# Altium schematic sheet 09 - M.2-SDMMC2.SchDoc
size B; CompanyName: Microchip Technology Inc.; Organization: Microchip Technology; Address1: 2355 West Chandler Blvd.; Address2: Chandler, AZ  85224; Address4: USA; DocumentNumber: 9; SheetNumber: 9; SheetTotal: 15; SheetTitle: M.2  Connector
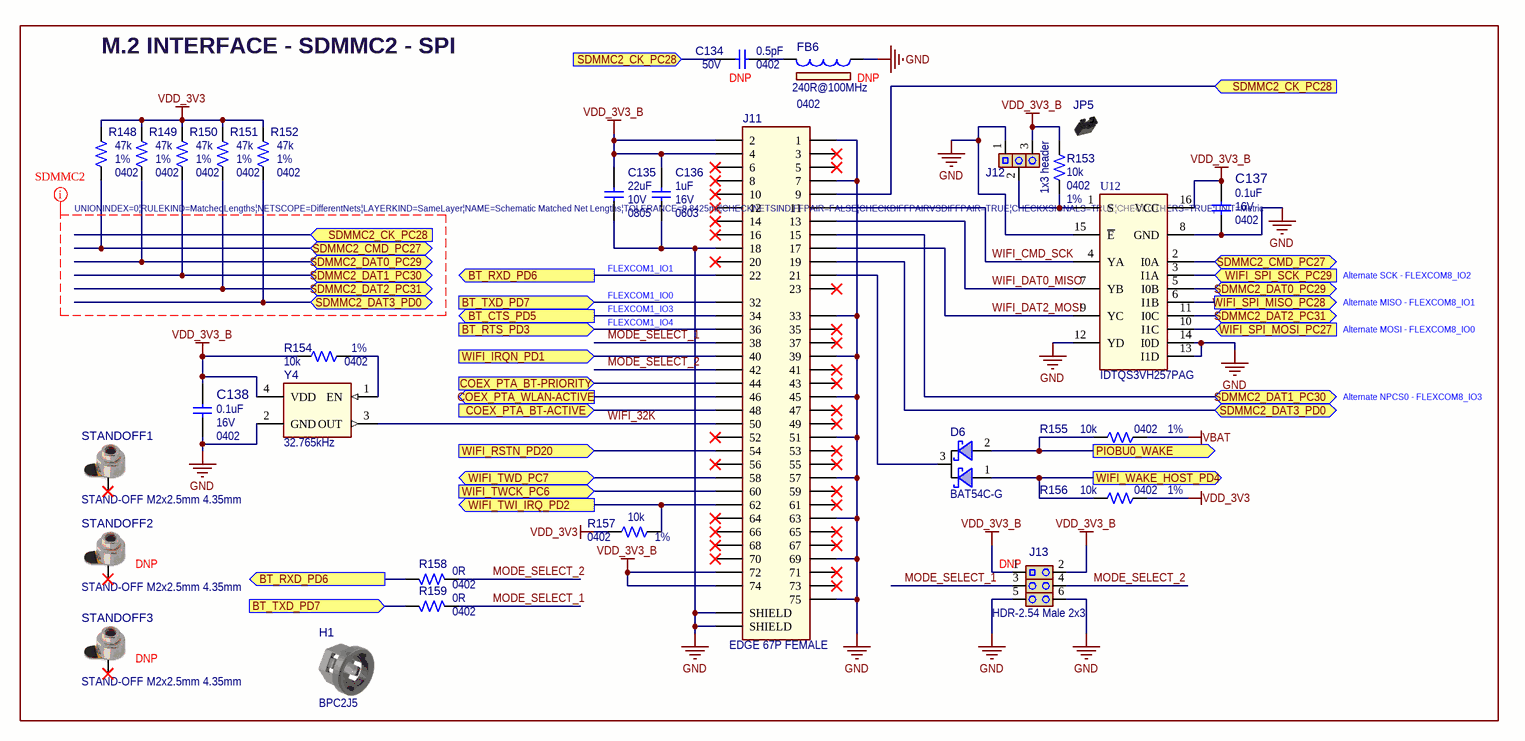
[diagram p0: 09 - M.2-SDMMC2.SchDoc]

## Parts
C134  value 0.5pF  Voltage: 50V  Package: 0402  Populated: DNP  [CAP_C_0402]  (hidden comment: Capacitor NP)
C135  value 22uF  Voltage: 10V  Package: 0805  [CAP_C_0805]  (hidden comment: Capacitor NP)
C136  value 1uF  Voltage: 16V  Package: 0603  [CAP_C_0603]  (hidden comment: Capacitor NP)
C137  value 0.1uF  Voltage: 16V  Package: 0402  [CAP_C_0402]  (hidden comment: Capacitor NP)
C138  value 0.1uF  Voltage: 16V  Package: 0402  [CAP_C_0402]  (hidden comment: Capacitor NP)
D6  value BAT54C-G  [SOT-23-3]  (hidden comment: Diode Schottky Dual CK)
FB6  value 240R@100MHz  Package: 0402  Populated: DNP  [IND_C_0402]  (hidden comment: Ferrite Bead)
H1  BPC2J5  [BPC2J5]  (no BOM)
J11  value EDGE 67P FEMALE  [CON_EDGE-CARD_SMD_RA_TE_2199230-4]  (hidden comment: CONN EDGE DUAL FEMALE_2199230-4)
J12  value 1x3 header  [HDR_M_2.54_1x3]  (hidden comment: Header 1x3)
J13  value HDR-2.54 Male 2x3  Populated: DNP  [HDR_M_2.54_2x3]  (hidden comment: Header 2x3)
JP5  Jumper Mechanical  [Jumper_Mechanical]  (value not drawn)  (mechanical)
R148  value 47k  Package: 0402  Tolerance: 1%  [RES_C_0402]  (hidden comment: Resistor)
R149  value 47k  Package: 0402  Tolerance: 1%  [RES_C_0402]  (hidden comment: Resistor)
R150  value 47k  Package: 0402  Tolerance: 1%  [RES_C_0402]  (hidden comment: Resistor)
R151  value 47k  Package: 0402  Tolerance: 1%  [RES_C_0402]  (hidden comment: Resistor)
R152  value 47k  Package: 0402  Tolerance: 1%  [RES_C_0402]  (hidden comment: Resistor)
R153  value 10k  Package: 0402  Tolerance: 1%  [RES_C_0402]  (hidden comment: Resistor)
R154  value 10k  Package: 0402  Tolerance: 1%  [RES_C_0402]  (hidden comment: Resistor)
R155  value 10k  Package: 0402  Tolerance: 1%  [RES_C_0402]  (hidden comment: Resistor)
R156  value 10k  Package: 0402  Tolerance: 1%  [RES_C_0402]  (hidden comment: Resistor)
R157  value 10k  Package: 0402  Tolerance: 1%  [RES_C_0402]  (hidden comment: Resistor)
R158  value 0R  Package: 0402  [RES_C_0402]  (hidden comment: Resistor)
R159  value 0R  Package: 0402  [RES_C_0402]  (hidden comment: Resistor)
STANDOFF1  value STAND-OFF M2x2.5mm 4.35mm  [MECH_HW_STAND-OFF_9774025243]  (hidden comment: Standoff M-F)
STANDOFF2  value STAND-OFF M2x2.5mm 4.35mm  Populated: DNP  [MECH_HW_STAND-OFF_9774025243]  (hidden comment: Standoff M-F)
STANDOFF3  value STAND-OFF M2x2.5mm 4.35mm  Populated: DNP  [MECH_HW_STAND-OFF_9774025243]  (hidden comment: Standoff M-F)
U12  value IDTQS3VH257PAG  [TSSOP-16]  (hidden comment: IDTQS3VH257 TSSOP-16)
Y4  value 32.765kHz  [OSCILLATOR_ASAK_L2W1.6H0.7]  (hidden comment: OSCILLATOR 4 Pins)

## Ports
BT_CTS_PD5 (out), BT_RTS_PD3 (in), BT_RXD_PD6 (out), BT_TXD_PD7 (in), COEX_PTA_BT-ACTIVE (in), COEX_PTA_BT-PRIORITY (in), COEX_PTA_WLAN-ACTIVE (out), PIOBU0_WAKE (out), SDMMC2_CK_PC28 (in), SDMMC2_CMD_PC27 (bidir), SDMMC2_DAT0_PC29 (bidir), SDMMC2_DAT1_PC30 (bidir), SDMMC2_DAT2_PC31 (bidir), SDMMC2_DAT3_PD0 (bidir), WIFI_IRQN_PD1 (in), WIFI_RSTN_PD20 (in), WIFI_SPI_MISO_PC28 (out), WIFI_SPI_MOSI_PC27 (in), WIFI_SPI_SCK_PC29 (in), WIFI_TWCK_PC6 (in), WIFI_TWD_PC7 (bidir), WIFI_TWI_IRQ_PD2 (out), WIFI_WAKE_HOST_PD4 (out)

## Nets
GND: C135.1 C136.1 C137.2 C138.2 FB6.1 J11.1 J11.7 J11.18 J11.33 J11.39 J11.45 J11.51 J11.57 J11.63 J11.69 J11.75 J11.S1(SHIELD) J11.S2(SHIELD) J12.1 J13.5 J13.6 U12.8(GND) U12.12(YD) U12.13(I1D) U12.14(I0D) U12.15(~{E}) Y4.2(GND)
VBAT: R155.1
VDD_3V3: R148.1 R149.1 R150.1 R151.1 R152.1 R156.1 R157.2
VDD_3V3_B: C135.2 C136.2 C137.1 C138.1 J11.2 J11.4 J11.72 J11.74 J12.3 J13.1 J13.2 R153.1 R154.2 U12.16(VCC) Y4.4(VDD)
BT_CTS_PD5: J11.34 ; port BT_CTS_PD5
BT_RTS_PD3: J11.36 ; port BT_RTS_PD3
BT_RXD_PD6: J11.22 R158.1 ; port BT_RXD_PD6
BT_TXD_PD7: J11.32 R159.1 ; port BT_TXD_PD7
COEX_PTA_BT-ACTIVE: J11.48 ; port COEX_PTA_BT-ACTIVE
COEX_PTA_BT-PRIORITY: J11.44 ; port COEX_PTA_BT-PRIORITY
COEX_PTA_WLAN-ACTIVE: J11.46 ; port COEX_PTA_WLAN-ACTIVE
MODE_SELECT_1: J11.38 J13.3 R159.2
MODE_SELECT_2: J11.42 J13.4 R158.2
PIOBU0_WAKE: D6.2(A) R155.2 ; port PIOBU0_WAKE
SDMMC2_CK_PC28: C134.2 J11.9 ; port SDMMC2_CK_PC28
SDMMC2_CMD_PC27: R148.2 U12.2(I0A) ; port SDMMC2_CMD_PC27
SDMMC2_DAT0_PC29: R149.2 U12.5(I0B) ; port SDMMC2_DAT0_PC29
SDMMC2_DAT1_PC30: J11.15 R150.2 ; port SDMMC2_DAT1_PC30
SDMMC2_DAT2_PC31: R151.2 U12.11(I0C) ; port SDMMC2_DAT2_PC31
SDMMC2_DAT3_PD0: J11.19 R152.2 ; port SDMMC2_DAT3_PD0
WIFI_32K: J11.50 Y4.3(OUT)
WIFI_CMD_SCK: J11.11 U12.4(YA)
WIFI_DAT0_MISO: J11.13 U12.7(YB)
WIFI_DAT2_MOSI: J11.17 U12.9(YC)
WIFI_IRQN_PD1: J11.40 ; port WIFI_IRQN_PD1
WIFI_RSTN_PD20: J11.54 ; port WIFI_RSTN_PD20
WIFI_SPI_MISO_PC28: U12.6(I1B) ; port WIFI_SPI_MISO_PC28
WIFI_SPI_MOSI_PC27: U12.10(I1C) ; port WIFI_SPI_MOSI_PC27
WIFI_SPI_SCK_PC29: U12.3(I1A) ; port WIFI_SPI_SCK_PC29
WIFI_TWCK_PC6: J11.60 ; port WIFI_TWCK_PC6
WIFI_TWD_PC7: J11.58 ; port WIFI_TWD_PC7
WIFI_TWI_IRQ_PD2: J11.62 R157.1 ; port WIFI_TWI_IRQ_PD2
WIFI_WAKE_HOST_PD4: D6.1(A) R156.2 ; port WIFI_WAKE_HOST_PD4
NetC134_1: C134.1 FB6.2
NetD6_3: D6.3(KK) J11.21
NetJ12_2: J12.2 R153.2 U12.1(S)
NetR154_1: R154.1 Y4.1(EN)

Not connected (* = marked no-connect by the designer): J11 3* 5* 6* 8* 10* 12* 14* 16* 20* 23* 35* 37* 41* 43* 47* 49* 52* 53* 55* 56* 59* 61* 64* 65* 66* 67* 68* 70* 71* 73*; STANDOFF1 1*; STANDOFF2 1*; STANDOFF3 1*

## Layout directives
net class SDMMC2; rule Matched Net Lengths [Tolerance = 0.25mm]: (no net found under the mark)

## Notes on the sheet
- M.2 INTERFACE - SDMMC2 - SPI
- FLEXCOM1_IO1
- FLEXCOM1_IO0
- Alternate SCK - FLEXCOM8_IO2
- Alternate MISO - FLEXCOM8_IO1
- FLEXCOM1_IO3
- FLEXCOM1_IO4
- Alternate MOSI - FLEXCOM8_IO0
- Alternate NPCS0 - FLEXCOM8_IO3
- Project Owner:
- PCB Layout Contact:
- PartNumber:
- Project Title
- Variant:
- Sheet Title
- Size
- B
- SCH #:
- PCB #:
- Rev:
- Date:
- Sheet
- Designed with
- Altium.com <http://go.altium.com/MicrochipLandingPage_Evaluation.html>
- File:

## Library data of the parts
C134 = CAP0274: Manufacturer 1: KEMET; Manufacturer Part Number 1: C0402C508C5GACTU; Description_: CAP CER 0.5pF 50V 0.25pF NP0 SMD 0402; Dev Tools Status: Production; Tolerance: 0.25pF; Temperature Coefficient: NP0; Type: Ceramic; Restricted Sourcing: No; MCHP-ID: CAP0274; Revision: 2; Symbol: Capacitor NP; Status: MCL Design; ComponentLink1URL: https://chn-vm-apps.microchip.com/mchprepo/parts/Datasheets/MLCC_ordering_code.pdf; ComponentLink1Description: SVN Datasheet; ComponentLink2URL: C:\ALTIUM_WORK\00001_MCHP-CDB\Datasheets\MLCC_ordering_code.pdf; ComponentLink2Description: Local Datasheet; ComponentLink3URL: C:\ALTIUM_WORK\00001_MCHP-CDB\Library\LibraryRefs\Capacitor NP.SchLib; ComponentLink3Description: Open Symbol; ComponentLink4URL: C:\ALTIUM_WORK\00001_MCHP-CDB\Library\Footprints\CAP_C_0402.PcbLib; ComponentLink4Description: Open Footprint; ComponentLink5Description: Open Footprint 2; ComponentLink6Description: Open Footprint 3; ComponentLink7Description: Open Footprint 4; Operating Temperature: -55C to +125C; Category: Capacitor; Manufacturer 2: KYOCERA AVX; Manufacturer Part Number 2: 04025A0R5CAT2A; Manufacturer 3: Yageo; Manufacturer Part Number 3: CC0402CRNPO9BNR50; Supplier 1: Digi-Key; Supplier Part Number 1: 399-1000-2-ND; Supplier 2: Digi-Key; Supplier Part Number 2: 478-1057-2-ND; Supplier 3: Digi-Key; Supplier Part Number 3: 311-1001-2-ND; Quantity Override: 1
C135 = CAP1618: Manufacturer 1: TDK Corporation; Manufacturer Part Number 1: C2012X7S1A226M125AC; Description_: CAP CER 22uF 10V 20% X7S SMD 0805; Dev Tools Status: Production; Tolerance: 20%; Type: Ceramic; Populated: YES; Temperature Coefficient: X7S; Owner: Razvan Cristescu; Restricted Sourcing: No; MCHP-ID: CAP1618; Revision: 3; Symbol: Capacitor NP; Status: MCL Design; ComponentLink1URL: https://chn-vm-apps.microchip.com/mchprepo/parts/Datasheets/mlcc_commercial_general_en.pdf; ComponentLink1Description: SVN Datasheet; ComponentLink2URL: C:\ALTIUM_WORK\00001_MCHP-CDB\Datasheets\mlcc_commercial_general_en.pdf; ComponentLink2Description: Local Datasheet; ComponentLink3URL: C:\ALTIUM_WORK\00001_MCHP-CDB\Library\LibraryRefs\Capacitor NP.SchLib; ComponentLink3Description: Open Symbol; ComponentLink4URL: C:\ALTIUM_WORK\00001_MCHP-CDB\Library\Footprints\CAP_C_0805.PcbLib; ComponentLink4Description: Open Footprint; ComponentLink5Description: Open Footprint 2; ComponentLink6Description: Open Footprint 3; ComponentLink7Description: Open Footprint 4; Operating Temperature: -55C to +125C; Category: Capacitor; Supplier 1: Digi-Key; Supplier Part Number 1: 445-14560-1-ND; Quantity Override: 1
C136 = CAP0265: Manufacturer 1: AVX; Manufacturer Part Number 1: 0603YD105KAT2A; Description_: CAP CER 1uF 16V 10% X5R SMD 0603; Dev Tools Status: Production; Tolerance: 10%; Temperature Coefficient: X5R; Type: Ceramic; Populated: Yes; MCHP-ID: CAP0265; Revision: 4; Symbol: Capacitor NP; Status: MCL Design; ComponentLink1URL: https://chn-vm-apps.microchip.com/mchprepo/parts/Datasheets/smccp.pdf; ComponentLink1Description: SVN Datasheet; ComponentLink2URL: C:\ALTIUM_WORK\00001_MCHP-CDB\Datasheets\smccp.pdf; ComponentLink2Description: Local Datasheet; ComponentLink3URL: C:\ALTIUM_WORK\00001_MCHP-CDB\Library\LibraryRefs\Capacitor NP.SchLib; ComponentLink3Description: Open Symbol; ComponentLink4URL: C:\ALTIUM_WORK\00001_MCHP-CDB\Library\Footprints\CAP_C_0603.PcbLib; ComponentLink4Description: Open Footprint; ComponentLink5Description: Open Footprint 2; ComponentLink6Description: Open Footprint 3; ComponentLink7Description: Open Footprint 4; Operating Temperature: -55C to +85C; Category: Capacitor; Manufacturer 2: KEMET; Manufacturer Part Number 2: C0603C105K4PACTU; Manufacturer 3: TDK; Manufacturer Part Number 3: C1608X5R1C105K080AA; Manufacturer 4: Vishay Vitramon; Manufacturer Part Number 4: VJ0603G105KXJCW1BC; Manufacturer 5: Yageo; Manufacturer Part Number 5: CC0603KRX5R7BB105; Supplier 1: Digi-Key; Supplier Part Number 1: 478-1249-1-ND; Supplier 2: Digi-Key; Supplier Part Number 2: 399-5090-1-ND; Supplier 3: Digi-Key; Supplier Part Number 3: 445-1416-1-ND; Supplier 4: Digi-Key; Supplier Part Number 4: 720-1851-1-ND; Supplier 5: Digi-Key; Supplier Part Number 5: 311-1444-1-ND; Quantity Override: 1
C137 C138 = CAP1033: Manufacturer 1: Hottech; Manufacturer Part Number 1: C1005B104K160NT; Description_: CAP CER 0.1uF 16V 10% X7R SMD 0402; Dev Tools Status: Production; Tolerance: 10%; Owner: Sompoch Loboonlert; Populated: Yes; Temperature Coefficient: X7R; Type: Ceramic; Restricted Sourcing: No; MCHP-ID: CAP1033; Revision: 10; Symbol: Capacitor NP; Status: MCL Design; ComponentLink1URL: https://chn-vm-apps.microchip.com/mchprepo/parts/Datasheets/L0005E.pdf; ComponentLink1Description: SVN Datasheet; ComponentLink2URL: C:\ALTIUM_WORK\00001_MCHP-CDB\Datasheets\L0005E.pdf; ComponentLink2Description: Local Datasheet; ComponentLink3URL: C:\ALTIUM_WORK\00001_MCHP-CDB\Library\LibraryRefs\Capacitor NP.SchLib; ComponentLink3Description: Open Symbol; ComponentLink4URL: C:\ALTIUM_WORK\00001_MCHP-CDB\Library\Footprints\CAP_C_0402.PcbLib; ComponentLink4Description: Open Footprint; ComponentLink5Description: Open Footprint 2; ComponentLink6Description: Open Footprint 3; ComponentLink7Description: Open Footprint 4; Operating Temperature: -55C to +125C; Category: Capacitor; Supplier 1: Hottech; Supplier Part Number 1: C1005B104K160NT; Quantity Override: 1; Manufacturer 2: KEMET; Manufacturer Part Number 2: C0402C104K4RAC7867; Manufacturer 3: Samsung Electro-Mechanics; Manufacturer Part Number 3: CL05B104KO5NNNC; Manufacturer 4: Würth Elektronik; Manufacturer Part Number 4: 885012205037; Manufacturer 5: Samsung Electro-Mechanics; Manufacturer Part Number 5: CL05B104KO5NNND; Manufacturer 6: Samsung Electro-Mechanics; Manufacturer Part Number 6: CL05B104KO5NNNO; Manufacturer 7: Yageo; Manufacturer Part Number 7: CC0402KRX7R7BB104; Supplier 2: Digi-Key; Supplier Part Number 2: 399-C0402C104K4RAC7867TR-ND; Supplier 3: Digi-Key; Supplier Part Number 3: 1276-1001-1-ND; Supplier 4: Digi-Key; Supplier Part Number 4: 732-7532-1-ND; Supplier 5: Mouser; Supplier Part Number 5: 187-CL05B104KO5NNND; Supplier 6: Samsung Electro-Mechanics; Supplier Part Number 6: CL05B104KO5NNNO; Supplier 7: Yageo; Supplier Part Number 7: CC0402KRX7R7BB104
D6 = DIODE1841: Manufacturer 1: Comchip Technology; Description_: DIO SCTKY ARRAY BAT54C-G 520mV 200mA 30V SMD SOT-23-3; Dev Tools Status: Production; Type: Schottky Array; Forward Current: 200mA; Power: 225mW; Reverse Current: 2mA; Reverse Recovery Time: 5ns; Reverse Voltage: 30V; Owner: Cristina Salanti; Populated: YES; Restricted Sourcing: No; MCHP-ID: DIODE1841; Revision: 1; Symbol: Diode Schottky Dual CK; Status: MCL Design; Package: SOT-23-3; ComponentLink1URL: https://chn-vm-apps.microchip.com/mchprepo/parts/Datasheets/BAT54.pdf; ComponentLink1Description: SVN Datasheet; ComponentLink2URL: C:\ALTIUM_WORK\00001_MCHP-CDB\Datasheets\BAT54.pdf; ComponentLink2Description: Local Datasheet; ComponentLink3URL: C:\ALTIUM_WORK\00001_MCHP-CDB\Library\LibraryRefs\Diode Schottky Dual CK.SchLib; ComponentLink3Description: Open Symbol; ComponentLink4URL: C:\ALTIUM_WORK\00001_MCHP-CDB\Library\Footprints\SOT-23-3.PcbLib; ComponentLink4Description: Open Footprint; ComponentLink5Description: Open Footprint 2; ComponentLink6Description: Open Footprint 3; ComponentLink7Description: Open Footprint 4; Operating Temperature: -55C to +125C; Category: Diode; Manufacturer Part Number 1: BAT54C-G; Supplier 1: Digi-Key; Supplier Part Number 1: 641-1320-1-ND; Quantity Override: 1
FB6 = FB1020: Manufacturer 1: TDK Corporation; Manufacturer Part Number 1: MMZ1005Y241CT000; MCHP-ID: FB1020; Description_: FERRITE 240R @100MHz 300mA SMD 0402; Dev Tools Status: Design; Owner: Joerg Buehrer; DCR: 260 mR; Revision: 1; Symbol: Ferrite Bead; Status: MCL Design; ComponentLink1URL: https://chn-vm-apps.microchip.com/mchprepo/parts/Datasheets/beads_commercial_signal_mmz1005_en.pdf; ComponentLink1Description: SVN Datasheet; ComponentLink2URL: C:\ALTIUM_WORK\00001_MCHP-CDB\Datasheets\beads_commercial_signal_mmz1005_en.pdf; ComponentLink2Description: Local Datasheet; ComponentLink3URL: C:\ALTIUM_WORK\00001_MCHP-CDB\Library\LibraryRefs\Ferrite Bead.SchLib; ComponentLink3Description: Open Symbol; ComponentLink4URL: C:\ALTIUM_WORK\00001_MCHP-CDB\Library\Footprints\IND_C_0402.PcbLib; ComponentLink4Description: Open Footprint; ComponentLink5Description: Open Footprint 2; ComponentLink6Description: Open Footprint 3; ComponentLink7Description: Open Footprint 4; Operating Temperature: -55°C ~ 125°C; Type: Ferrite Bead; Category: Inductor; Manufacturer 2: TDK Corporation; Manufacturer Part Number 2: MMZ1005Y241CT000; Supplier 1: Digi-Key; Supplier Part Number 1: 445-2153-1-ND; Supplier 2: Mouser; Supplier Part Number 2: 810-MMZ1005Y241CT000; Quantity Override: 1
H1 = MECH0299: Manufacturer 1: Alead Technology Co., Ltd.; Description_: MECH HW WASHER PCB LOCK PLASTIC BPC2J5; Dev Tools Status: Production; Owner: Dragos Danaila; Populated: MECH; MCHP-ID: MECH0299; Value: BPC2J5; Revision: 1; Symbol: BPC2J5; Status: MCL Design; ComponentLink1Description: SVN Datasheet; ComponentLink2Description: Local Datasheet; ComponentLink3URL: C:\ALTIUM_WORK\00001_MCHP-CDB\Library\LibraryRefs\BPC2J5.SchLib; ComponentLink3Description: Open Symbol; ComponentLink4URL: C:\ALTIUM_WORK\00001_MCHP-CDB\Library\Footprints\BPC2J5.PcbLib; ComponentLink4Description: Open Footprint; ComponentLink5Description: Open Footprint 2; ComponentLink6Description: Open Footprint 3; ComponentLink7Description: Open Footprint 4; Type: Washer; Category: Hardware; Manufacturer Part Number 1: BPC2J5; Supplier 1: Alead Technology Co., Ltd.; Supplier Part Number 1: BPC2J5; Quantity Override: 1
J11 = CON2690: Manufacturer 1: TE Connectivity AMP Connectors; Description_: CON EDGE MINI M.2 0.5mm 67P Female SMD R/A; Dev Tools Status: Design; Owner: Pilar Alcaine; Populated: YES; MCHP-ID: CON2690; Revision: 1; Symbol: CONN EDGE DUAL FEMALE_2199230-4; Status: MCL Design; ComponentLink1URL: https://chn-vm-apps.microchip.com/mchprepo/parts/Datasheets/ENG_CD_2199230_B3.pdf; ComponentLink1Description: SVN Datasheet; ComponentLink2URL: C:\ALTIUM_WORK\00001_MCHP-CDB\Datasheets\ENG_CD_2199230_B3.pdf; ComponentLink2Description: Local Datasheet; ComponentLink3URL: C:\ALTIUM_WORK\00001_MCHP-CDB\Library\LibraryRefs\CONN EDGE DUAL FEMALE_2199230-4.SchLib; ComponentLink3Description: Open Symbol; ComponentLink4URL: C:\ALTIUM_WORK\00001_MCHP-CDB\Library\Footprints\CON_EDGE-CARD_SMD_RA_TE_2199230-4.PcbLib; ComponentLink4Description: Open Footprint; ComponentLink5Description: Open Footprint 2; ComponentLink6Description: Open Footprint 3; ComponentLink7Description: Open Footprint 4; Type: Edge Card; Category: Connector; Manufacturer Part Number 1: 2199230-4; Supplier 1: Digi-Key; Supplier Part Number 1: A115904CT-ND; Quantity Override: 1; Operating Temperature: -40C to +80C; Assembly Type: SMD
J12 = CON2491: Manufacturer 1: METZ CONNECT USA Inc.; Manufacturer Part Number 1: PR20203VBNN; Description_: CON HDR-2.54 Male 1x3 Gold 6.10MH TH VERT; Dev Tools Status: Production; Owner: Dragos Danaila; Current: 3A; Populated: YES; MCHP-ID: CON2491; Revision: 2; Symbol: Header 1x3; Status: MCL Design; ComponentLink1URL: https://chn-vm-apps.microchip.com/mchprepo/parts/Datasheets/Data_sheet_PR202XXVBNN.PDF; ComponentLink1Description: SVN Datasheet; ComponentLink2URL: C:\ALTIUM_WORK\00001_MCHP-CDB\Datasheets\Data_sheet_PR202XXVBNN.PDF; ComponentLink2Description: Local Datasheet; ComponentLink3URL: C:\ALTIUM_WORK\00001_MCHP-CDB\Library\LibraryRefs\Header 1x3.SchLib; ComponentLink3Description: Open Symbol; ComponentLink4URL: C:\ALTIUM_WORK\00001_MCHP-CDB\Library\Footprints\HDR_M_2.54_1x3.PcbLib; ComponentLink4Description: Open Footprint; ComponentLink5Description: Open Footprint 2; ComponentLink6Description: Open Footprint 3; ComponentLink7Description: Open Footprint 4; Type: Header 2.54mm; Category: Connector; Supplier 1: Digi-Key; Supplier Part Number 1: Deprecated_1849-1003-ND; Quantity Override: 1; Operating Temperature: -40C to +105C; Assembly Type: TH
J13 = CON0322: Manufacturer 1: Sullins Connector Solutions; Manufacturer Part Number 1: PBC03DAAN; Description_: CON HDR-2.54 Male 2x3 Gold 5.84MH TH VERT; Dev Tools Status: Production; MCHP-ID: CON0322; Revision: 3; Symbol: Header 2x3; Status: MCL Design; ComponentLink1URL: https://chn-vm-apps.microchip.com/mchprepo/parts/Datasheets/HTSW-XXX-XX-XXX-X-XX-XX-XX-MKT.pdf; ComponentLink1Description: SVN Datasheet; ComponentLink2URL: C:\ALTIUM_WORK\00001_MCHP-CDB\Datasheets\HTSW-XXX-XX-XXX-X-XX-XX-XX-MKT.pdf; ComponentLink2Description: Local Datasheet; ComponentLink3URL: C:\ALTIUM_WORK\00001_MCHP-CDB\Library\LibraryRefs\Header 2x3.SchLib; ComponentLink3Description: Open Symbol; ComponentLink4URL: C:\ALTIUM_WORK\00001_MCHP-CDB\Library\Footprints\HDR_M_2.54_2x3.PcbLib; ComponentLink4Description: Open Footprint; ComponentLink5Description: Open Footprint 2; ComponentLink6Description: Open Footprint 3; ComponentLink7Description: Open Footprint 4; Type: Header 2.54mm; Category: Connector; Manufacturer 2: SHENZHEN JUNHAO ENGINEERING; Manufacturer Part Number 2: 213-0617-0021-401; Manufacturer 3: Samtec; Manufacturer Part Number 3: HTSW-103-07-G-D; Supplier 1: Digi-Key; Supplier Part Number 1: S2011E-03-ND; Supplier 2: SHENZHEN JUNHAO ENGINEERING; Supplier Part Number 2: 213-0617-0021-401; Supplier 3: Samtec; Supplier Part Number 3: HTSW-103-07-G-D; Quantity Override: 1
JP5 = MECH0174: Manufacturer 1: Wurth Electronics Inc.; Manufacturer Part Number 1: 60900213421; Value: Shunt 2.54mm 1x2; Description_: MECH HW JUMPER 2.54mm 1x2 GOLD; Dev Tools Status: Production; Owner: Narasimha Murthy; Populated: MECH; MCHP-ID: MECH0174; Revision: 1; Symbol: Jumper Mechanical; Status: MCL Design; ComponentLink1URL: https://chn-vm-apps.microchip.com/mchprepo/parts/Datasheets/60900213421.pdf; ComponentLink1Description: SVN Datasheet; ComponentLink2URL: C:\ALTIUM_WORK\00001_MCHP-CDB\Datasheets\60900213421.pdf; ComponentLink2Description: Local Datasheet; ComponentLink3URL: C:\ALTIUM_WORK\00001_MCHP-CDB\Library\LibraryRefs\Jumper Mechanical.SchLib; ComponentLink3Description: Open Symbol; ComponentLink4URL: C:\ALTIUM_WORK\00001_MCHP-CDB\Library\Footprints\Jumper_Mechanical.PcbLib; ComponentLink4Description: Open Footprint; ComponentLink5Description: Open Footprint 2; ComponentLink6Description: Open Footprint 3; ComponentLink7Description: Open Footprint 4; Type: Jumper; Category: Hardware; Supplier 1: Digi-Key; Supplier Part Number 1: 732-2678-ND; Quantity Override: 1
R148-R152 = RES2131: Manufacturer 1: Panasonic - ECG; Manufacturer Part Number 1: ERJ-2RKF4702X; Description_: RES TKF 47k 1% 1/10W SMD 0402; Dev Tools Status: Design; Voltage: 50V; Temperature Coeffcient: 100ppm/C; Power: 1/10W; Owner: Mike Ragsdale; Populated: YES; MCHP-ID: RES2131; Revision: 0; Symbol: Resistor; Status: MCL Design; ComponentLink1URL: https://chn-vm-apps.microchip.com/mchprepo/parts/Datasheets/AOA0000C304.pdf; ComponentLink1Description: SVN Datasheet; ComponentLink2URL: C:\ALTIUM_WORK\00001_MCHP-CDB\Datasheets\AOA0000C304.pdf; ComponentLink2Description: Local Datasheet; ComponentLink3URL: C:\ALTIUM_WORK\00001_MCHP-CDB\Library\LibraryRefs\Resistor.SchLib; ComponentLink3Description: Open Symbol; ComponentLink4URL: C:\ALTIUM_WORK\00001_MCHP-CDB\Library\Footprints\RES_C_0402.PcbLib; ComponentLink4Description: Open Footprint; ComponentLink5Description: Open Footprint 2; ComponentLink6Description: Open Footprint 3; ComponentLink7Description: Open Footprint 4; Operating Temperature: -55C to +155C; Category: Resistor; Type: RES SMD; Composition: TKF; Supplier 1: Digi-Key; Supplier Part Number 1: P47.0KLTR-ND; Quantity Override: 1
R153 R155 R156 = RSMT1019: Manufacturer 1: Panasonic; Manufacturer Part Number 1: ERJ-2RKF1002X; Description_: RES TKF 10k 1% 1/10W SMD 0402; Dev Tools Status: Production; Voltage: 50V; Temperature Coeffcient: 100ppm/C; Power: 1/10W; Owner: Brent Lanphear; Populated: Yes; MCHP-ID: RSMT1019; Revision: 2; Symbol: Resistor; Status: MCL Design; ComponentLink1URL: https://chn-vm-apps.microchip.com/mchprepo/parts/Datasheets/AOA0000CE2.pdf; ComponentLink1Description: SVN Datasheet; ComponentLink2URL: C:\ALTIUM_WORK\00001_MCHP-CDB\Datasheets\AOA0000CE2.pdf; ComponentLink2Description: Local Datasheet; ComponentLink3URL: C:\ALTIUM_WORK\00001_MCHP-CDB\Library\LibraryRefs\Resistor.SchLib; ComponentLink3Description: Open Symbol; ComponentLink4URL: C:\ALTIUM_WORK\00001_MCHP-CDB\Library\Footprints\RES_C_0402.PcbLib; ComponentLink4Description: Open Footprint; ComponentLink5Description: Open Footprint 2; ComponentLink6Description: Open Footprint 3; ComponentLink7Description: Open Footprint 4; Operating Temperature: -55C to +155C; Category: Resistor; Type: RES SMD; Composition: TKF; Supplier 1: Digi-Key; Supplier Part Number 1: P10.0KLCT-ND; Quantity Override: 1
R154 R157 = RSMT1019: Manufacturer 1: Panasonic; Manufacturer Part Number 1: ERJ-2RKF1002X; Description_: RES TKF 10k 1% 1/10W SMD 0402; Dev Tools Status: Production; Voltage: 50V; Temperature Coeffcient: 100ppm/C; Power: 1/10W; Owner: Brent Lanphear; Populated: YES; MCHP-ID: RSMT1019; Revision: 2; Symbol: Resistor; Status: MCL Design; ComponentLink1URL: https://chn-vm-apps.microchip.com/mchprepo/parts/Datasheets/AOA0000CE2.pdf; ComponentLink1Description: SVN Datasheet; ComponentLink2URL: C:\ALTIUM_WORK\00001_MCHP-CDB\Datasheets\AOA0000CE2.pdf; ComponentLink2Description: Local Datasheet; ComponentLink3URL: C:\ALTIUM_WORK\00001_MCHP-CDB\Library\LibraryRefs\Resistor.SchLib; ComponentLink3Description: Open Symbol; ComponentLink4URL: C:\ALTIUM_WORK\00001_MCHP-CDB\Library\Footprints\RES_C_0402.PcbLib; ComponentLink4Description: Open Footprint; ComponentLink5Description: Open Footprint 2; ComponentLink6Description: Open Footprint 3; ComponentLink7Description: Open Footprint 4; Operating Temperature: -55C to +155C; Category: Resistor; Type: RES SMD; Composition: TKF; Supplier 1: Digi-Key; Supplier Part Number 1: P10.0KLCT-ND; Quantity Override: 1
R158 R159 = RSMT1040: Manufacturer 1: Yageo; Manufacturer Part Number 1: RC0402JR-070RL; Description_: RES TKF 0R 1/16W SMD 0402; Dev Tools Status: Production; Power: 1/16W; Populated: Yes; Owner: Sompoch Loboonlert; MCHP-ID: RSMT1040; Revision: 3; Symbol: Resistor; Status: MCL Design; ComponentLink1URL: https://chn-vm-apps.microchip.com/mchprepo/parts/Datasheets/PYu-RC0402_51_RoHS_L_6.pdf; ComponentLink1Description: SVN Datasheet; ComponentLink2URL: C:\ALTIUM_WORK\00001_MCHP-CDB\Datasheets\PYu-RC0402_51_RoHS_L_6.pdf; ComponentLink2Description: Local Datasheet; ComponentLink3URL: C:\ALTIUM_WORK\00001_MCHP-CDB\Library\LibraryRefs\Resistor.SchLib; ComponentLink3Description: Open Symbol; ComponentLink4URL: C:\ALTIUM_WORK\00001_MCHP-CDB\Library\Footprints\RES_C_0402.PcbLib; ComponentLink4Description: Open Footprint; ComponentLink5Description: Open Footprint 2; ComponentLink6Description: Open Footprint 3; ComponentLink7Description: Open Footprint 4; Operating Temperature: -55C to +155C; Category: Resistor; Type: RES SMD; Composition: TKF; Manufacturer 2: Stackpole Electronics Inc; Manufacturer Part Number 2: RMCF0402ZT0R00; Supplier 1: Digi-Key; Supplier Part Number 1: 311-0.0JRCT-ND; Supplier 2: Digi-Key; Supplier Part Number 2: RMCF0402ZT0R00TR-ND; Quantity Override: 1
STANDOFF1 = MECH0512: Manufacturer 1: Würth Elektronik; Manufacturer Part Number 1: 9774025243R; Description_: MECH HW STAND-OFF M2x2.5mm 4.35mm Steel TH Solderable; Dev Tools Status: Design; Owner: Pilar Alcaine; Populated: YES; MCHP-ID: MECH0512; Revision: 1; Symbol: MECH_HW_STAND-OFF_TH_SOLDERABLE; Status: MCL Design; ComponentLink1URL: https://chn-vm-apps.microchip.com/mchprepo/parts/Datasheets/9774025243R.pdf; ComponentLink1Description: SVN Datasheet; ComponentLink2URL: C:\ALTIUM_WORK\00001_MCHP-CDB\Datasheets\9774025243R.pdf; ComponentLink2Description: Local Datasheet; ComponentLink3URL: C:\ALTIUM_WORK\00001_MCHP-CDB\Library\LibraryRefs\MECH_HW_STAND-OFF_TH_SOLDERABLE.SchLib; ComponentLink3Description: Open Symbol; ComponentLink4URL: C:\ALTIUM_WORK\00001_MCHP-CDB\Library\Footprints\MECH_HW_STAND-OFF_9774025243.PcbLib; ComponentLink4Description: Open Footprint; ComponentLink5Description: Open Footprint 2; ComponentLink6Description: Open Footprint 3; ComponentLink7Description: Open Footprint 4; Type: Stand-off; Category: Hardware; Supplier 1: Digi-Key; Supplier Part Number 1: 732-7079-1-ND; Quantity Override: 1
STANDOFF2 STANDOFF3 = MECH0512: Manufacturer 1: Würth Elektronik; Manufacturer Part Number 1: 9774025243R; Description_: MECH HW STAND-OFF M2x2.5mm 4.35mm Steel TH Solderable; Dev Tools Status: Design; Owner: Pilar Alcaine; MCHP-ID: MECH0512; Revision: 1; Symbol: MECH_HW_STAND-OFF_TH_SOLDERABLE; Status: MCL Design; ComponentLink1URL: https://chn-vm-apps.microchip.com/mchprepo/parts/Datasheets/9774025243R.pdf; ComponentLink1Description: SVN Datasheet; ComponentLink2URL: C:\ALTIUM_WORK\00001_MCHP-CDB\Datasheets\9774025243R.pdf; ComponentLink2Description: Local Datasheet; ComponentLink3URL: C:\ALTIUM_WORK\00001_MCHP-CDB\Library\LibraryRefs\MECH_HW_STAND-OFF_TH_SOLDERABLE.SchLib; ComponentLink3Description: Open Symbol; ComponentLink4URL: C:\ALTIUM_WORK\00001_MCHP-CDB\Library\Footprints\MECH_HW_STAND-OFF_9774025243.PcbLib; ComponentLink4Description: Open Footprint; ComponentLink5Description: Open Footprint 2; ComponentLink6Description: Open Footprint 3; ComponentLink7Description: Open Footprint 4; Type: Stand-off; Category: Hardware; Supplier 1: Digi-Key; Supplier Part Number 1: 732-7079-1-ND; Quantity Override: 1
U12 = IC1517: Manufacturer 1: IDT, Integrated Device Technology Inc; Manufacturer Part Number 1: QS3VH257PAG; MCHP-ID: IC1517; Description_: IC SWITCHER  MUX/DEMUX IDTQS3VH257 QUAD 2:1 TSSOP-16; Dev Tools Status: Production; Owner: Ilie Galan; Populated: YES; Restricted Sourcing: No; Revision: 1; Symbol: IDTQS3VH257 TSSOP-16; Status: MCL Design; Package: TSSOP-16; ComponentLink1URL: https://chn-vm-apps.microchip.com/mchprepo/parts/Datasheets/IDT_QS3VH257_DST_20140224.pdf; ComponentLink1Description: SVN Datasheet; ComponentLink2URL: C:\ALTIUM_WORK\00001_MCHP-CDB\Datasheets\IDT_QS3VH257_DST_20140224.pdf; ComponentLink2Description: Local Datasheet; ComponentLink3URL: C:\ALTIUM_WORK\00001_MCHP-CDB\Library\LibraryRefs\IDTQS3VH257 TSSOP-16.SchLib; ComponentLink3Description: Open Symbol; ComponentLink4URL: C:\ALTIUM_WORK\00001_MCHP-CDB\Library\Footprints\TSSOP-16.PcbLib; ComponentLink4Description: Open Footprint; ComponentLink5Description: Open Footprint 2; ComponentLink6Description: Open Footprint 3; ComponentLink7Description: Open Footprint 4; Operating Temperature: -40C to +85C; Type: Switcher; Category: IC; Supplier 1: Digi-Key; Supplier Part Number 1: 800-2205-ND; Quantity Override: 1
Y4 = OSC1182: Manufacturer 1: Abracon LLC; Manufacturer Part Number 1: ASAK-32.768KHZ-LRS-T; Description_: OSCILLATOR 32.768kHz SMD DFN-4; Dev Tools Status: Design; Owner: Ilie Galan; Voltage: 3.3V; Tolerance: 3ppm; Load Capacitance: 15pF; Supply Current: 120uA; Populated: YES; MCHP-ID: OSC1182; Revision: A; Symbol: Oscillator 4 Pins; Status: MCL Design; ComponentLink1URL: https://chn-vm-apps.microchip.com/mchprepo/parts/Datasheets/ASAK.pdf; ComponentLink1Description: SVN Datasheet; ComponentLink2URL: C:\ALTIUM_WORK\00001_MCHP-CDB\Datasheets\ASAK.pdf; ComponentLink2Description: Local Datasheet; ComponentLink3URL: C:\ALTIUM_WORK\00001_MCHP-CDB\Library\LibraryRefs\Oscillator 4 Pins.SchLib; ComponentLink3Description: Open Symbol; ComponentLink4URL: C:\ALTIUM_WORK\00001_MCHP-CDB\Library\Footprints\OSCILLATOR_ASAK_L2W1.6H0.7.PcbLib; ComponentLink4Description: Open Footprint; ComponentLink5Description: Open Footprint 2; ComponentLink6Description: Open Footprint 3; ComponentLink7Description: Open Footprint 4; Operating Temperature: -10C to +60C; Package: DFN-4; Type: Oscillator; Category: Crystal/Oscillator; Supplier 1: Digi-Key; Supplier Part Number 1: 535-13275-1-ND; Supplier 2: Mouser; Supplier Part Number 2: 815-ASAK-32.768LRST; Quantity Override: 1